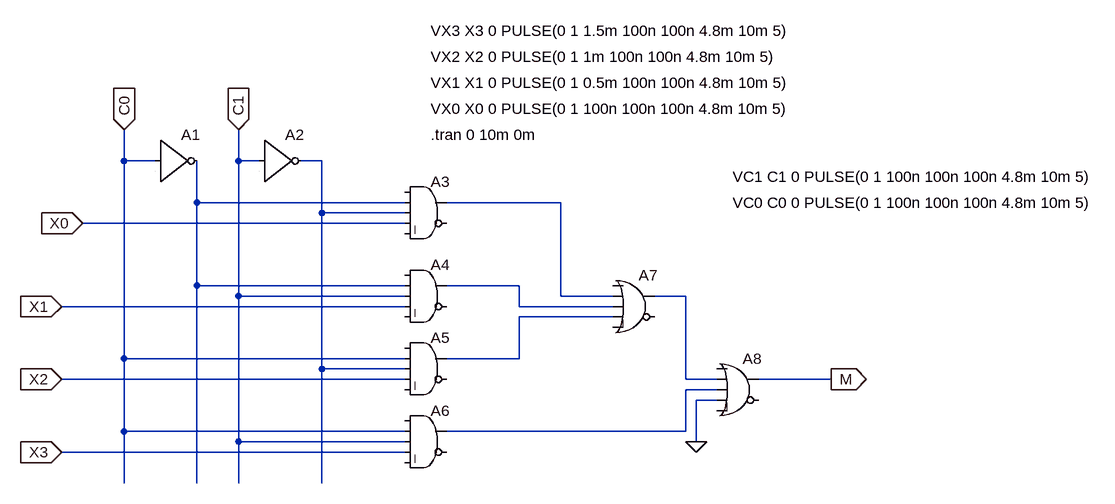
[diagram p0: schematic Part1.asc]
Part1.asc, the LTspice schematic file:
Version 4
SHEET 1 1544 680
WIRE 16 80 16 32
WIRE 64 80 16 80
WIRE 192 80 192 32
WIRE 224 80 192 80
WIRE 320 80 288 80
WIRE 128 144 128 80
WIRE 448 144 128 144
WIRE 688 144 512 144
WIRE 320 160 320 80
WIRE 448 160 320 160
WIRE 448 176 -48 176
WIRE 128 272 128 144
WIRE 448 272 128 272
WIRE 624 272 512 272
WIRE 192 288 192 80
WIRE 448 288 192 288
WIRE 688 288 688 144
WIRE 768 288 688 288
WIRE 880 288 832 288
WIRE 448 304 -80 304
WIRE 624 304 624 272
WIRE 768 304 624 304
WIRE 768 320 624 320
WIRE 16 384 16 80
WIRE 448 384 16 384
WIRE 624 384 624 320
WIRE 624 384 512 384
WIRE 320 400 320 160
WIRE 448 400 320 400
WIRE 448 416 -80 416
WIRE 880 416 880 288
WIRE 928 416 880 416
WIRE 1104 416 992 416
WIRE 928 432 880 432
WIRE 928 448 896 448
WIRE 16 496 16 384
WIRE 448 496 16 496
WIRE 880 496 880 432
WIRE 880 496 512 496
WIRE 192 512 192 288
WIRE 448 512 192 512
WIRE 896 512 896 448
WIRE 448 528 -80 528
WIRE 16 576 16 496
WIRE 128 576 128 272
WIRE 192 576 192 512
WIRE 320 576 320 400
FLAG 16 32 C0
IOPIN 16 32 In
FLAG 192 32 C1
IOPIN 192 32 In
FLAG -48 176 X0
IOPIN -48 176 In
FLAG -80 304 X1
IOPIN -80 304 In
FLAG -80 416 X2
IOPIN -80 416 In
FLAG -80 528 X3
IOPIN -80 528 In
FLAG 1104 416 M
IOPIN 1104 416 Out
FLAG 896 512 0
SYMBOL Digital\\inv 64 16 R0
SYMATTR InstName A1
SYMBOL Digital\\inv 224 16 R0
SYMATTR InstName A2
SYMBOL Digital\\and 480 96 R0
SYMATTR InstName A3
SYMBOL Digital\\and 480 224 R0
SYMATTR InstName A4
SYMBOL Digital\\and 480 336 R0
SYMATTR InstName A5
SYMBOL Digital\\and 480 448 R0
SYMATTR InstName A6
SYMBOL Digital\\or 800 240 R0
SYMATTR InstName A7
SYMBOL Digital\\or 960 368 R0
SYMATTR InstName A8
TEXT 488 -80 Left 2 !VX2 X2 0 PULSE(0 1 1m 100n 100n 4.8m 10m 5)
TEXT 488 -40 Left 2 !VX1 X1 0 PULSE(0 1 0.5m 100n 100n 4.8m 10m 5)
TEXT 488 0 Left 2 !VX0 X0 0 PULSE(0 1 100n 100n 100n 4.8m 10m 5)
TEXT 488 40 Left 2 !.tran 0 10m 0m
TEXT 488 -120 Left 2 !VX3 X3 0 PULSE(0 1 1.5m 100n 100n 4.8m 10m 5)
TEXT 952 104 Left 2 !VC1 C1 0 PULSE(0 1 100n 100n 100n 4.8m 10m 5)
TEXT 952 144 Left 2 !VC0 C0 0 PULSE(0 1 100n 100n 100n 4.8m 10m 5)

The netlist it stands for:
* Part1.asc
A1 C0 0 0 0 0 N002 0 0 BUF
A2 C1 0 0 0 0 N001 0 0 BUF
A3 0 N002 N001 X0 0 0 N003 0 AND
A4 0 N002 C1 X1 0 0 N004 0 AND
A5 0 C0 N001 X2 0 0 N006 0 AND
A6 0 C0 C1 X3 0 0 N007 0 AND
A7 0 N003 N004 N006 0 0 N005 0 OR
A8 0 N005 N007 0 0 0 M 0 OR
VX2 X2 0 PULSE(0 1 1m 100n 100n 4.8m 10m 5)
VX1 X1 0 PULSE(0 1 0.5m 100n 100n 4.8m 10m 5)
VX0 X0 0 PULSE(0 1 100n 100n 100n 4.8m 10m 5)
.tran 0 10m 0m
VX3 X3 0 PULSE(0 1 1.5m 100n 100n 4.8m 10m 5)
VC1 C1 0 PULSE(0 1 100n 100n 100n 4.8m 10m 5)
VC0 C0 0 PULSE(0 1 100n 100n 100n 4.8m 10m 5)
.backanno
.end